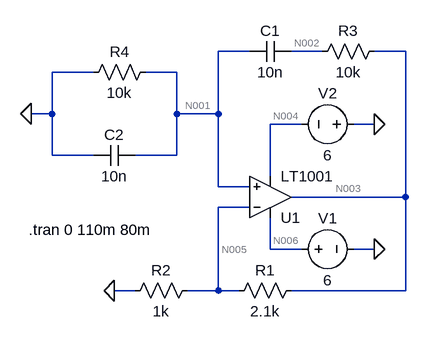
[diagram p0: schematic Wein Bridge Oscillator 2.asc]
Wein Bridge Oscillator 2.asc, the LTspice schematic file:
Version 4
SHEET 1 880 680
WIRE 192 -80 144 -80
WIRE 304 -80 256 -80
WIRE 432 -80 384 -80
WIRE -48 -48 -112 -48
WIRE 80 -48 32 -48
WIRE -112 16 -112 -48
WIRE -112 16 -144 16
WIRE 80 16 80 -48
WIRE 144 16 144 -80
WIRE 144 16 80 16
WIRE 272 32 224 32
WIRE 384 32 352 32
WIRE -112 80 -112 16
WIRE -48 80 -112 80
WIRE 80 80 80 16
WIRE 80 80 16 80
WIRE 224 112 224 32
WIRE 144 128 144 16
WIRE 192 128 144 128
WIRE 432 144 432 -80
WIRE 432 144 256 144
WIRE 192 160 144 160
WIRE 224 224 224 176
WIRE 272 224 224 224
WIRE 384 224 352 224
WIRE 16 288 -16 288
WIRE 144 288 144 160
WIRE 144 288 96 288
WIRE 176 288 144 288
WIRE 432 288 432 144
WIRE 432 288 256 288
FLAG 384 224 0
FLAG 384 32 0
FLAG -16 288 0
FLAG -144 16 0
SYMBOL OpAmps\\LT1001 224 208 M180
SYMATTR InstName U1
SYMBOL res 272 272 R90
WINDOW 0 0 56 VBottom 2
WINDOW 3 32 56 VTop 2
SYMATTR InstName R1
SYMATTR Value 2.1k
SYMBOL voltage 256 224 R270
WINDOW 0 32 56 VTop 2
WINDOW 3 -32 56 VBottom 2
WINDOW 123 0 0 Left 0
WINDOW 39 0 0 Left 0
SYMATTR InstName V1
SYMATTR Value 6
SYMBOL voltage 368 32 R90
WINDOW 0 -32 56 VBottom 2
WINDOW 3 32 56 VTop 2
WINDOW 123 0 0 Left 0
WINDOW 39 0 0 Left 0
SYMATTR InstName V2
SYMATTR Value 6
SYMBOL res 112 272 R90
WINDOW 0 0 56 VBottom 2
WINDOW 3 32 56 VTop 2
SYMATTR InstName R2
SYMATTR Value 1k
SYMBOL cap 256 -96 R90
WINDOW 0 0 32 VBottom 2
WINDOW 3 32 32 VTop 2
SYMATTR InstName C1
SYMATTR Value 10n
SYMBOL res 400 -96 R90
WINDOW 0 0 56 VBottom 2
WINDOW 3 32 56 VTop 2
SYMATTR InstName R3
SYMATTR Value 10k
SYMBOL res 48 -64 R90
WINDOW 0 0 56 VBottom 2
WINDOW 3 32 56 VTop 2
SYMATTR InstName R4
SYMATTR Value 10k
SYMBOL cap 16 64 R90
WINDOW 0 0 32 VBottom 2
WINDOW 3 32 32 VTop 2
SYMATTR InstName C2
SYMATTR Value 10n
TEXT -148 194 Left 2 !.tran 0 110m 80m

The netlist it stands for:
* Wein Bridge Oscillator 2.asc
XU1 N001 N005 N006 N004 N003 LT1001  ; pins In+ In- V+ V- OUT
R1 N003 N005 2.1k
V1 N006 0 6
V2 0 N004 6
R2 N005 0 1k
C1 N002 N001 10n
R3 N003 N002 10k
R4 N001 0 10k
C2 N001 0 10n
.tran 0 110m 80m
.lib LTC.lib
.backanno
.end

* Results of the author's LTspice run, read from the files saved beside the schematic
* Operating Point, zero values left out:
*   V(n006) = 6 V
*   V(n004) = -6 V
*   I(V2) = -2.25 mA
*   I(V1) = -2.25 mA
*   Ix(u1:3) = 2.25 mA
*   Ix(u1:4) = -2.25 mA
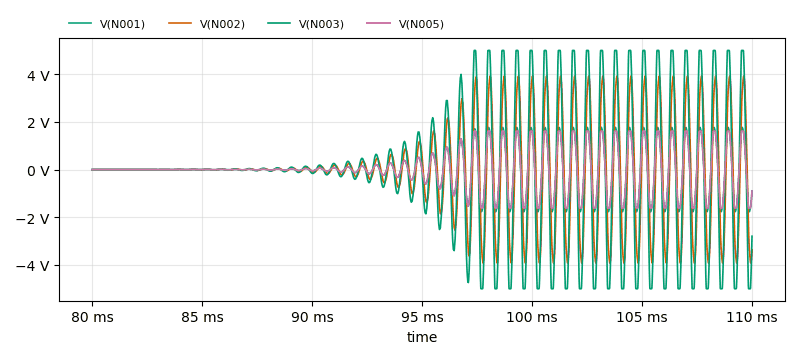
[diagram p1: Transient Analysis of Wein Bridge Oscillator 2.asc, plotted from the saved traces]
* Transient Analysis, 1 run:
*   V(N001): min -1.774 V, max 1.774 V, average -5.273 mV, rms 855.5 mV, last -893.5 mV
*   V(N002): min -3.926 V, max 3.926 V, average -7.742 mV, rms 1.918 V, last -3.369 V
*   V(N003): min -5.008 V, max 5.008 V, average -15.86 mV, rms 2.577 V, last -2.797 V
*   V(N005): min -1.615 V, max 1.615 V, average -5.116 mV, rms 831.3 mV, last -902.2 mV